# Altium schematic sheet Overview.SchDoc
size A; SheetNumber: 1; SheetTotal: 4
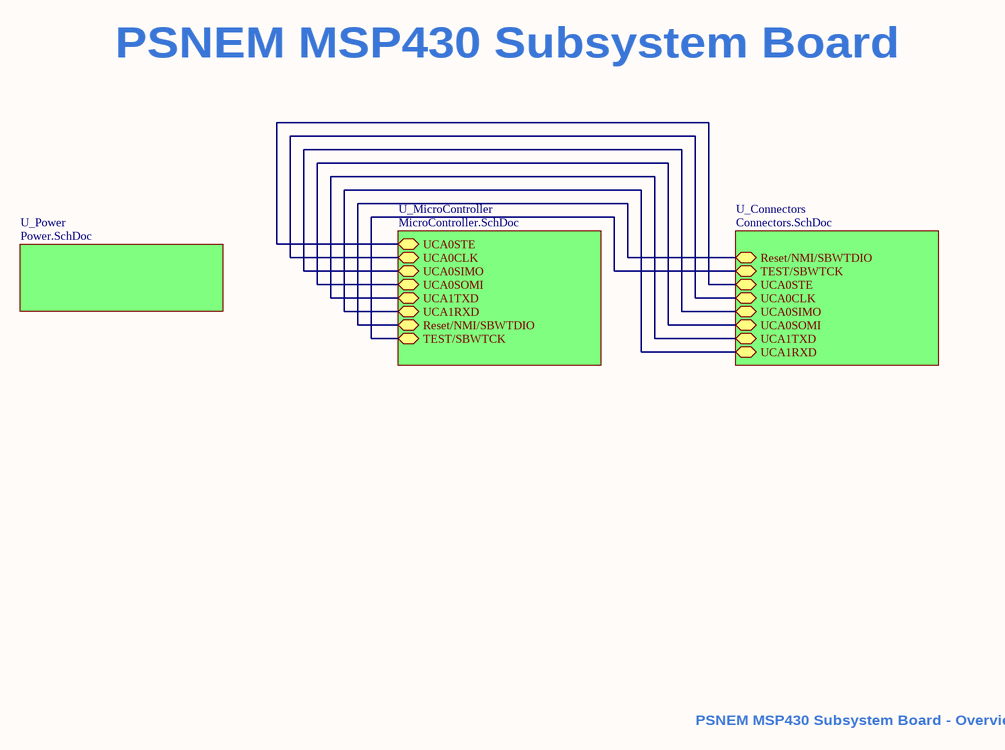
[diagram p0: Overview.SchDoc]

## Sub-sheets
U_Connectors = Connectors.SchDoc: Reset/NMI/SBWTDIO (bidir), TEST/SBWTCK (bidir), UCA0STE (bidir), UCA0CLK (bidir), UCA0SIMO (bidir), UCA0SOMI (bidir), UCA1TXD (bidir), UCA1RXD (bidir)
U_MicroController = MicroController.SchDoc: UCA0STE (bidir), UCA0CLK (bidir), UCA0SIMO (bidir), UCA0SOMI (bidir), UCA1TXD (bidir), UCA1RXD (bidir), Reset/NMI/SBWTDIO (bidir), TEST/SBWTCK (bidir)
U_Power = Power.SchDoc: no entries

## Nets
(unnamed): sheet U_Connectors/Reset/NMI/SBWTDIO, sheet U_MicroController/Reset/NMI/SBWTDIO
(unnamed): sheet U_Connectors/TEST/SBWTCK, sheet U_MicroController/TEST/SBWTCK
(unnamed): sheet U_Connectors/UCA0STE, sheet U_MicroController/UCA0STE
(unnamed): sheet U_Connectors/UCA0CLK, sheet U_MicroController/UCA0CLK
(unnamed): sheet U_Connectors/UCA0SIMO, sheet U_MicroController/UCA0SIMO
(unnamed): sheet U_Connectors/UCA0SOMI, sheet U_MicroController/UCA0SOMI
(unnamed): sheet U_Connectors/UCA1TXD, sheet U_MicroController/UCA1TXD
(unnamed): sheet U_Connectors/UCA1RXD, sheet U_MicroController/UCA1RXD

## Notes on the sheet
- PSNEM MSP430 Subsystem Board
- PSNEM MSP430 Subsystem Board - Overview